# Altium project Nine-axis Gyroscope Module.PrjPcb
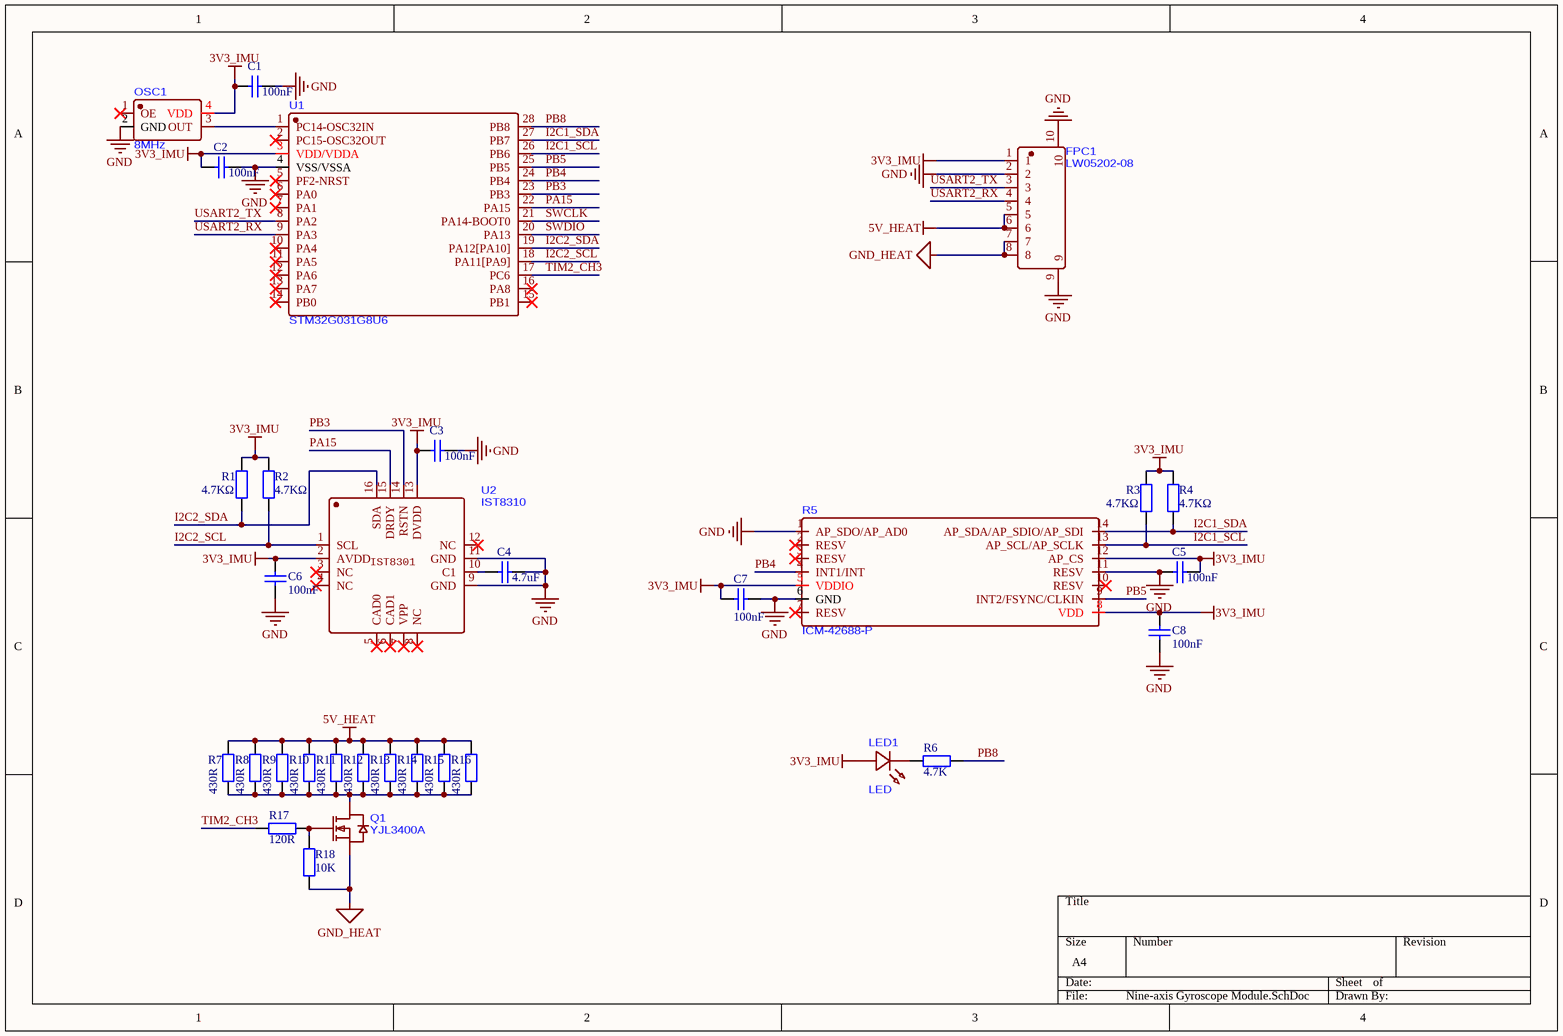
[diagram p0: Nine-axis Gyroscope Module.SchDoc]
1 sheet, 32 parts. Net scope: global (net labels, ports and power ports of the same name join across sheets).
Board file: Nine-axis Gyroscope Module.PcbDoc

## Sheet Nine-axis Gyroscope Module.SchDoc
size A4; SheetNumber: 1; SheetTotal: 1

### Parts
C1  100nF  [0402_C]
C2  100nF  [0402_C]
C3  100nF  [0402_C]
C4  4.7uF  [0402_C]
C5  100nF  [0402_C]
C6  100nF  [0402_C]
C7  100nF  [0402_C]
C8  100nF  [0402_C]
FPC1  LW05202-08  [FPC-SMD_8P-P0.50_LW05202-08]
LED1  LED  [LED0402-RD]
OSC1  8MHz  [OSC-SMD_4P-L2.0-W1.6-BL_ABRACON_AMPMAXXX]
Q1  YJL3400A  [SOT-23-3_L2.9-W1.3-P1.90-LS2.4-BR]
R1  4.7KΩ  [0402_R]
R2  4.7KΩ  [0402_R]
R3  4.7KΩ  [0402_R]
R4  4.7KΩ  [0402_R]
R5  ICM-42688-P  [LGA-14_L3.0-W2.5-P0.50-TL]
R6  4.7K  [0402_R]
R7  430R  [0402_R]
R8  430R  [0402_R]
R9  430R  [0402_R]
R10  430R  [0402_R]
R11  430R  [0402_R]
R12  430R  [0402_R]
R13  430R  [0402_R]
R14  430R  [0402_R]
R15  430R  [0402_R]
R16  430R  [0402_R]
R17  120R  [0402_R]
R18  10K  [0402_R]
U1  STM32G031G8U6  [UFQFPN-28_L4.0-W4.0-P0.50-BL]
U2  IST8310  [LGA-16-3*3]

### Nets
3V3_IMU: C1.1 C2.1 C3.1 C5.2 C6.2 C7.1 C8.2 FPC1.1 LED1.2(A) OSC1.4(VDD) R1.2 R2.2 R3.2 R4.2 R5.5(VDDIO) R5.8(VDD) R5.12(AP_CS) U1.3(VDD/VDDA) U2.2(AVDD) U2.13(DVDD)
5V_HEAT: FPC1.5 FPC1.6 R7.2 R8.2 R9.2 R10.2 R11.2 R12.2 R13.2 R14.2 R15.2 R16.2
GND: C1.2 C2.2 C3.2 C4.2 C5.1 C6.1 C7.2 C8.1 FPC1.2 FPC1.9 FPC1.10 OSC1.2(GND) R5.1(AP_SDO/AP_AD0) R5.6(GND) R5.11(RESV) U1.4(VSS/VSSA) U2.9(GND) U2.11(GND)
GND_HEAT: FPC1.7 FPC1.8 Q1.2(S) R18.2
I2C1_SCL: R3.1 R5.13(AP_SCL/AP_SCLK) U1.26(PB6)
I2C1_SDA: R4.1 R5.14(AP_SDA/AP_SDIO/AP_SDI) U1.27(PB7)
I2C2_SCL: R2.1 U1.18(PA11[PA9]) U2.1(SCL)
I2C2_SDA: R1.1 U1.19(PA12[PA10]) U2.16(SDA)
PA15: U1.22(PA15) U2.15(DRDY)
PB3: U1.23(PB3) U2.14(RSTN)
PB4: R5.4(INT1/INT) U1.24(PB4)
PB5: R5.9(INT2/FSYNC/CLKIN) U1.25(PB5)
PB8: R6.2 U1.28(PB8)
SWCLK: U1.21(PA14-BOOT0)
SWDIO: U1.20(PA13)
TIM2_CH3: R17.2 U1.17(PC6)
USART2_RX: FPC1.4 U1.9(PA3)
USART2_TX: FPC1.3 U1.8(PA2)
NetC4_1: C4.1 U2.10(C1)
NetLED1_1: LED1.1(K) R6.1
NetOSC1_3: OSC1.3(OUT) U1.1(PC14-OSC32IN)
NetQ1_1: Q1.1(G) R17.1 R18.1
NetQ1_3: Q1.3(D) R7.1 R8.1 R9.1 R10.1 R11.1 R12.1 R13.1 R14.1 R15.1 R16.1

Not connected (* = marked no-connect by the designer): OSC1 1(OE)*; R5 2(RESV)* 3(RESV)* 7(RESV)* 10(RESV)*; U1 2(PC15-OSC32OUT)* 5(PF2-NRST)* 6(PA0)* 7(PA1)* 10(PA4)* 11(PA5)* 12(PA6)* 13(PA7)* 14(PB0)* 15(PB1)* 16(PA8)*; U2 3(NC)* 4(NC)* 5(CAD0)* 6(CAD1)* 7(VPP)* 8(NC)* 12(NC)*

### Notes on the sheet
- (in symbol IST8310) IST8301

### Library data of the parts
C1-C3 C5-C8 = 0402 100nF (104) 10% 16V: 贴片电容; ComponentLink1Description: 供应商链接; ComponentLink1URL: http://www.szlcsc.com/product/details_1877.html; Package: 0402; Supplier: LC; SuppliersPartNumber: C1525
C4 = 0402 4.7uF (475) 20% 10V: 贴片电容; ComponentLink1Description: 供应商链接; ComponentLink1URL: http://www.szlcsc.com/product/details_24469.html; Package: 0402; Supplier: LC; SuppliersPartNumber: C23733
FPC1 = LW05202-08: system: connector
LED1 = TJ-S1005CL4T5ALC3DW-A5
OSC1 = AMPMAFC-25.0000T
R1-R4 R6-R18 = 0402 4.7KΩ (4701) 1%: 贴片电阻; ComponentLink1Description: 供应商链接; ComponentLink1URL: http://www.szlcsc.com/product/details_26643.html; Package: 0402; Supplier: LC; SuppliersPartNumber: C25900